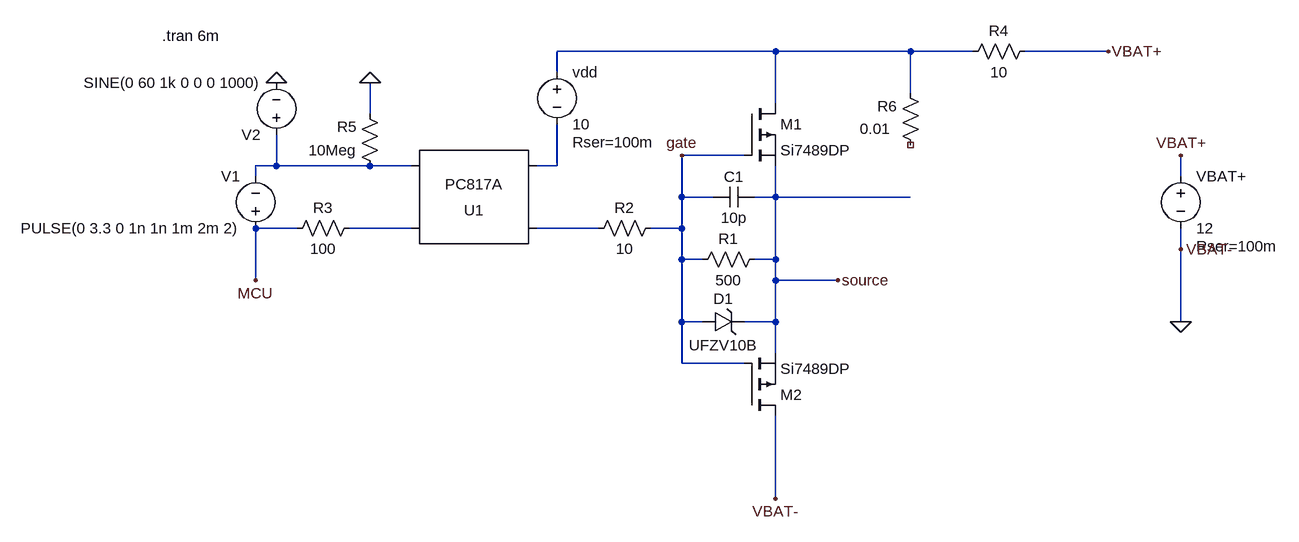
[diagram p0: schematic backToBack.asc]
backToBack.asc, the LTspice schematic file:
Version 4.1
SHEET 1 1380 948
WIRE 304 -64 -32 -64
WIRE 512 -64 304 -64
WIRE 608 -64 512 -64
WIRE 816 -64 688 -64
WIRE -32 -32 -32 -64
WIRE 512 0 512 -64
WIRE 304 16 304 -64
WIRE -320 32 -320 -16
WIRE 256 96 160 96
WIRE -464 112 -464 64
WIRE -464 112 -496 112
WIRE -320 112 -464 112
WIRE -256 112 -320 112
WIRE -32 112 -32 48
WIRE -32 112 -64 112
WIRE -496 128 -496 112
WIRE 928 128 928 96
WIRE 160 160 160 96
WIRE 208 160 160 160
WIRE 304 160 304 112
WIRE 304 160 272 160
WIRE 512 160 304 160
WIRE -432 208 -496 208
WIRE -256 208 -352 208
WIRE 32 208 -64 208
WIRE 160 208 160 160
WIRE 160 208 112 208
WIRE 928 240 928 208
WIRE 160 256 160 208
WIRE 192 256 160 256
WIRE 304 256 304 160
WIRE 304 256 272 256
WIRE -496 288 -496 208
WIRE 304 288 304 256
WIRE 400 288 304 288
WIRE 160 352 160 256
WIRE 192 352 160 352
WIRE 304 352 304 288
WIRE 304 352 256 352
WIRE 928 352 928 240
WIRE 304 400 304 352
WIRE 160 416 160 352
WIRE 256 416 160 416
WIRE 304 624 304 496
FLAG -320 -16 0
FLAG 928 96 VBAT+
FLAG 304 624 VBAT-
FLAG 816 -64 VBAT+
FLAG 928 240 VBAT-
FLAG -496 288 MCU
FLAG 160 96 gate
FLAG 400 288 source
FLAG 928 352 0
FLAG -464 -16 0
SYMBOL pmos 256 16 R0
SYMATTR InstName M1
SYMATTR Value Si7489DP
SYMBOL pmos 256 496 M180
SYMATTR InstName M2
SYMATTR Value Si7489DP
SYMBOL res 288 240 R90
WINDOW 0 0 56 VBottom 2
WINDOW 3 32 56 VTop 2
SYMATTR InstName R1
SYMATTR Value 500
SYMBOL zener 192 368 R270
WINDOW 0 36 32 VTop 2
WINDOW 3 -4 32 VBottom 2
SYMATTR InstName D1
SYMATTR Value UFZV10B
SYMBOL res 128 192 R90
WINDOW 0 0 56 VBottom 2
WINDOW 3 32 56 VTop 2
SYMATTR InstName R2
SYMATTR Value 10
SYMBOL voltage -496 224 R180
WINDOW 0 24 96 Left 2
WINDOW 3 24 16 Left 2
WINDOW 123 0 0 Left 0
WINDOW 39 0 0 Left 0
SYMATTR InstName V1
SYMATTR Value PULSE(0 3.3 0 1n 1n 1m 2m 2)
SYMBOL Optos\\PC817A -160 160 M180
SYMATTR InstName U1
SYMBOL res -336 192 R90
WINDOW 0 0 56 VBottom 2
WINDOW 3 32 56 VTop 2
SYMATTR InstName R3
SYMATTR Value 100
SYMBOL res 592 -48 R270
WINDOW 0 32 56 VTop 2
WINDOW 3 0 56 VBottom 2
SYMATTR InstName R4
SYMATTR Value 10
SYMBOL voltage -32 -48 R0
WINDOW 123 0 0 Left 0
WINDOW 39 24 124 Left 2
SYMATTR SpiceLine Rser=100m
SYMATTR InstName vdd
SYMATTR Value 10
SYMBOL voltage 928 112 R0
WINDOW 123 0 0 Left 0
WINDOW 39 24 124 Left 2
SYMATTR SpiceLine Rser=100m
SYMATTR InstName VBAT+
SYMATTR Value 12
SYMBOL res -304 128 R180
WINDOW 0 36 76 Left 2
WINDOW 3 36 40 Left 2
SYMATTR InstName R5
SYMATTR Value 10Meg
SYMBOL cap 272 144 R90
WINDOW 0 0 32 VBottom 2
WINDOW 3 32 32 VTop 2
SYMATTR InstName C1
SYMATTR Value 10p
SYMBOL voltage -464 80 R180
WINDOW 123 0 0 Left 0
WINDOW 39 0 0 Left 0
SYMATTR InstName V2
SYMATTR Value SINE(0 60 1k 0 0 0 1000)
SYMBOL res 528 96 R180
WINDOW 0 36 76 Left 2
WINDOW 3 47 41 Left 2
SYMATTR InstName R6
SYMATTR Value 0.01
TEXT -640 -88 Left 2 !.tran 6m

The netlist it stands for:
* backToBack.asc
M1 N001 gate source source Si7489DP
M2 0 gate source source Si7489DP
R1 source gate 500
D1 gate source UFZV10B
R2 gate N005 10
V1 MCU N002 PULSE(0 3.3 0 1n 1n 1m 2m 2)
X§U1 N004 N002 N005 N003 PC817 Igain=1m
R3 N004 MCU 100
R4 N001 VBAT+ 10
vdd N001 N003 10 Rser=100m
VBAT+ VBAT+ 0 12 Rser=100m
R5 N002 0 10Meg
C1 source gate 10p
V2 N002 0 SINE(0 60 1k 0 0 0 1000)
R6 NC_01 N001 0.01
.model D D
.lib standard.dio
.model NMOS NMOS
.model PMOS PMOS
.lib standard.mos
.tran 6m
.lib PC817.sub
.backanno
.end

* Results of the author's LTspice run, read from the files saved beside the schematic
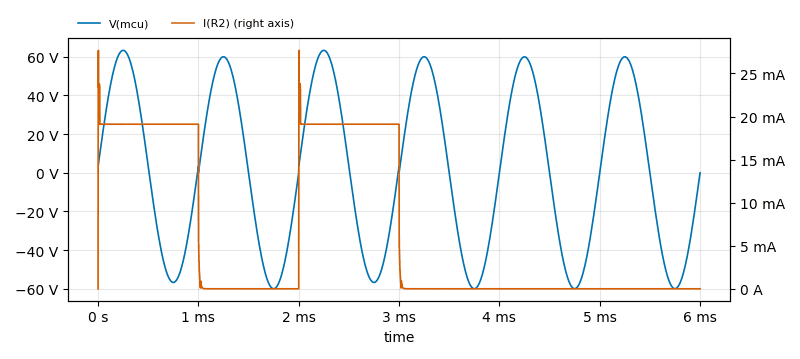
[diagram p1: Transient Analysis of backToBack.asc, plotted from the saved traces]
* Transient Analysis, 1 run:
*   V(mcu): min -60 V, max 63.3 V, average 1.1 V, rms 42.47 V, last 0 V
*   I(R2): min -1.632 µA, max 27.68 mA, average 6.413 mA, rms 11.08 mA, last 3.867 nA